# Altium project BlinkBoard_micro.PrjPcb (part 2 of 2)

## Sheet BlinkBoard_micro_v1_JACDAC.SchDoc: BlinkBoard
size A3; DrawnBy: Andrea; Revision: 0.1.0; SheetNumber: 3; SheetTotal: 3
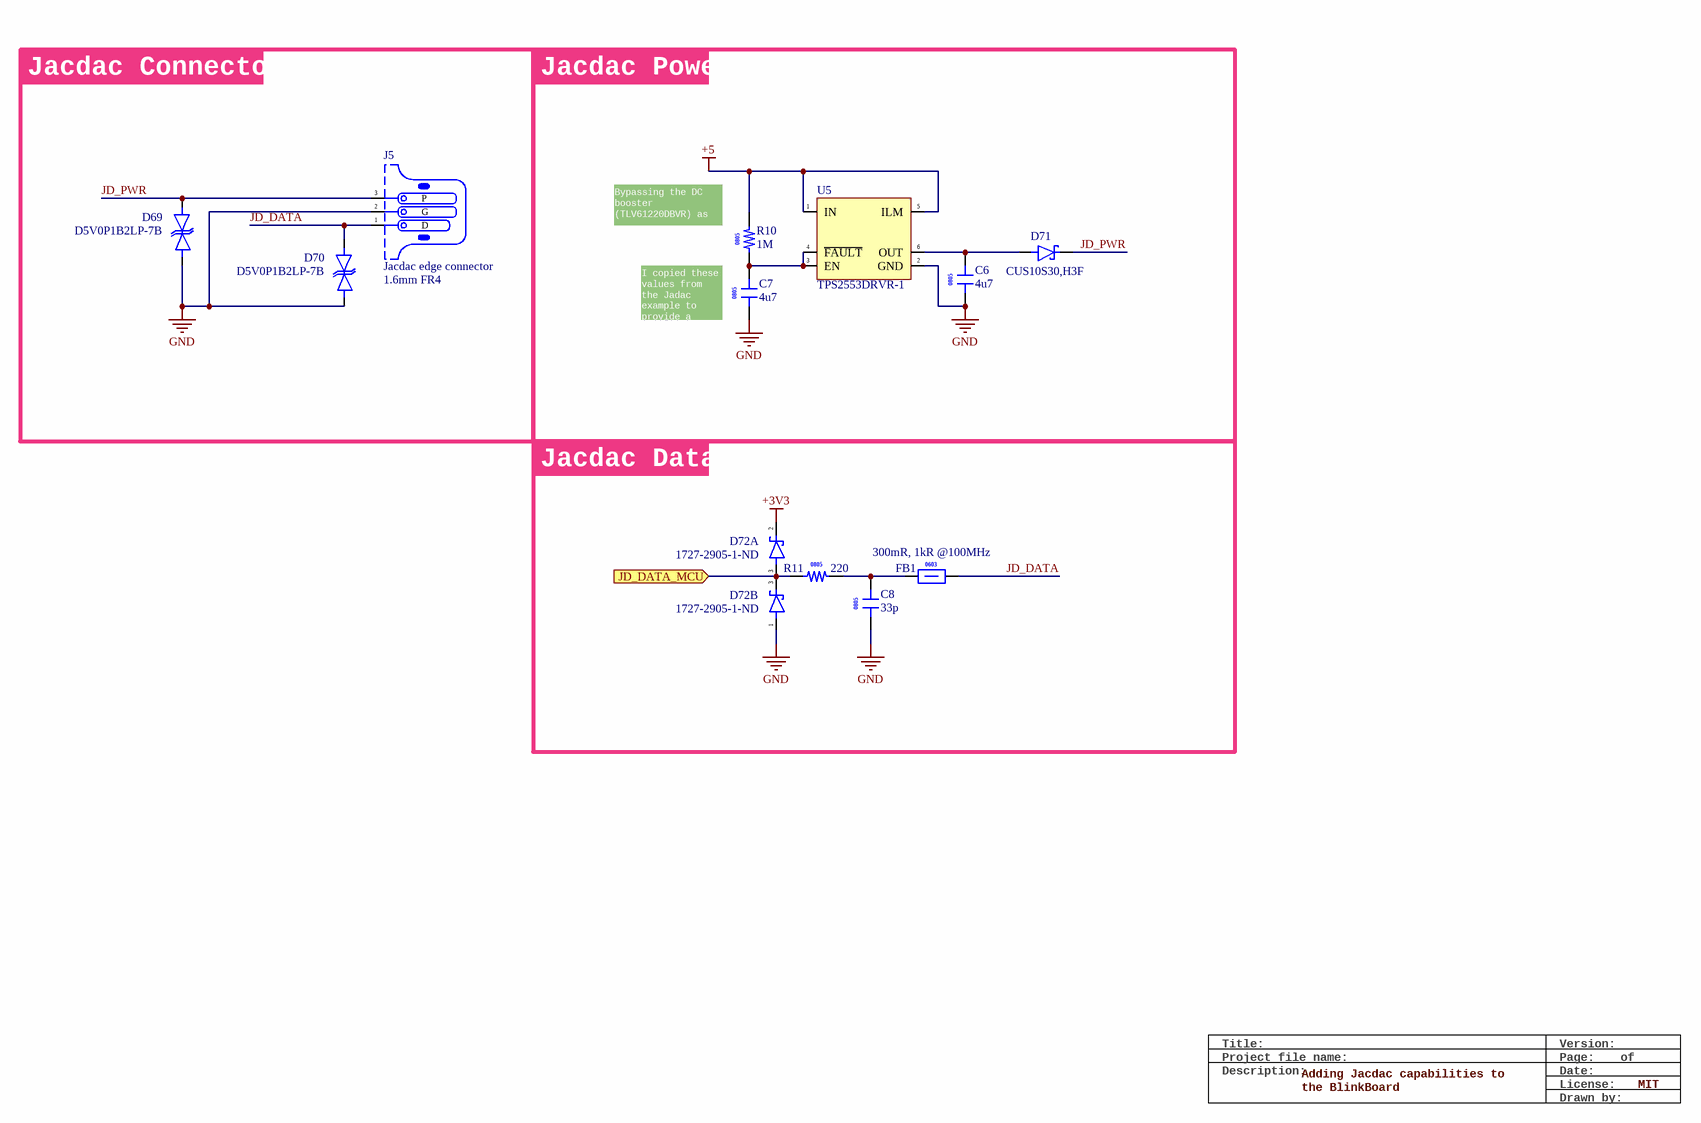
[diagram p2: BlinkBoard_micro_v1_JACDAC.SchDoc]

### Parts
C6  4u7  [C0805]
C7  4u7  [C0805]
C8  33p  [C0805]
D69  D5V0P1B2LP-7B  [D5V0P1B2LP]
D70  D5V0P1B2LP-7B  [D5V0P1B2LP]
D71  CUS10S30,H3F  [FP-USC-MFG]
D72  1727-2905-1-ND  [SOT323]  (parts A,B of 2)
FB1  300mR, 1kR @100MHz  [BEAD0603]
J5  Jacdac edge connector  PCB Type: 1.6mm FR4  [JACDAC_EDGE_CONNECTOR_NO_TRACES]  (no BOM)
R10  1M  [R0805]
R11  220  [R0805]
U5  TPS2553DRVR-1  [DRV0006A_V]

### Blocks framed on the sheet
Jacdac Connector: D69 D70 J5
Jacdac Power: C6 C7 D71 R10 U5
Jacdac Data: C8 D72 FB1 R11

### Ports
JD_DATA_MCU (in)

### Nets
+3V3: D72.2
+5: R10.2 U5.1(IN) U5.5(ILM)
GND: C6.1 C7.1 C8.1 D69.1 D70.1 D72.1 J5.2(G) U5.2(GND)
JD_DATA: D70.2 FB1.2 J5.1(D)
JD_PWR: D69.2 D71.1(C) J5.3(P)
NetC6_2: C6.2 D71.2(A) U5.6(OUT)
NetC7_2: C7.2 R10.1 U5.3(EN) U5.4(~{FAULT})
NetC8_2: C8.2 FB1.1 R11.2
NetD72_3: D72.3 R11.1 ; port JD_DATA_MCU

### Notes on the sheet
- (near R10) Bypassing the DC booster (TLV61220DBVR) as we already have 5V
- I copied these values from the Jadac example to provide a  750ms reset time
- Title:
- Description:
- Project file name:
- Drawn by:
- License:
- Page:
- Version:
- Date:
- of
- MIT
- Adding Jacdac capabilities to the BlinkBoard

### Library data of the parts
C6 C7 = C0805_4u7: Multilayer Ceramic Capacitors MLCC - SMD/SMT 4.7uF 6.3V X5R 10%; Manufacturer: Yageo; Manufacturer Part Number: CC0805KRX5R5BB475; Supplier 1: Digi-Key; RoHS: Yes; Category: Ceramic Capacitors; Stock 1: 19993; Mount: Surface Mount; Case/Package: 0805; Number of Pins: 2; Case Code (Imperial): 0805; Case Code (Metric): 2012; Weight: 0.000194oz; Min Operating Temperature: -55°C; Max Operating Temperature: 85°C; Capacitance: 4.7uF; Tolerance: 10%; Packaging: Tape and Reel; Voltage Rating (DC): 6.3V; Voltage Rating: 6.3V; Dielectric: X5R; Termination: SMD/SMT; Resistor Type: Ceramic; Series: CC; Length: 0.079inch; Width: 0.049inch; Thickness: 0.057inch; Lead Free: Lead Free; Halogen Free: Halogen Free; RoHS Compliant: Yes; ComponentLink1URL: http://www.mouser.com/ds/2/447/UPY-GPHC_X5R_4V-to-50V_25-1131599.pdf?src-supplier=Mouser; ComponentLink1Description: http://www.mouser.com/ds/2/447/UPY-GPHC_X5R_4V-to-50V_25-1131599.pdf?src-supplier=Mouser; ComponentLink2URL: http://components.arrow.com/part/dataview/0323_04166591?src-supplier=Arrow+Europe; ComponentLink2Description: http://components.arrow.com/part/dataview/0323_04166591?src-supplier=Arrow+Europe; ComponentLink3URL: http://www.yageo.com/documents/recent/UPY-GPHC_X5R_4V-to-50V_25.pdf?src-supplier=Digi-Key; ComponentLink3Description: http://www.yageo.com/documents/recent/UPY-GPHC_X5R_4V-to-50V_25.pdf?src-supplier=Digi-Key; ComponentLink4URL: http://www.yageo.com/documents/recent/UPY-GPHC_X5R_4V-to-50V_23.pdf?src-supplier=Digi-Key; ComponentLink4Description: http://www.yageo.com/documents/recent/UPY-GPHC_X5R_4V-to-50V_23.pdf?src-supplier=Digi-Key; Supplier Part Number 1: 311-3422-1-ND; Pricing 1: 1=0.17000, 10=0.12300, 50=0.07000, 100=0.05800, 500=0.04066, 1000=0.03365 (USD)
C8 = C0805_33p: Cap Ceramic 33pF 50V C0G 5% SMD 0805 125C Paper T/R; Manufacturer: Yageo; Manufacturer Part Number: CC0805JRNPO9BN330; Supplier 1: Digi-Key; RoHS: Yes; Category: Ceramic Capacitors; Stock 1: 41012; Mount: Surface Mount; Case/Package: 0805; Case Code (Imperial): 0805; Case Code (Metric): 2012; Material: Ceramic; Dielectric Material: Ceramic; Min Operating Temperature: -55°C; Max Operating Temperature: 125°C; Capacitance: 33pF; Package Quantity: 1; Voltage Rating: 50V; Voltage Rating (DC): 50V; Tolerance: 5%; Packaging: Tape and Reel; Dielectric: C0G; Termination: SMD/SMT; Resistor Type: Ceramic; Voltage: 50V; Series: CC; Length: 2mm; Width: 1.25mm; Height: 0.6mm; Thickness: 0.024inch; Depth: 1.25mm; Radiation Hardening: No; REACH SVHC: Unknown; Lead Free: Lead Free; RoHS Compliant: Yes; ComponentLink1URL: https://datasheet.ciiva.com/144/mlccorderingcode-144778.pdf?src-supplier=Digi-Key; ComponentLink1Description: https://datasheet.ciiva.com/144/mlccorderingcode-144778.pdf?src-supplier=Digi-Key; ComponentLink2URL: https://datasheet.ciiva.com/144/mlccorderingcode-144779.pdf?src-supplier=Digi-Key; ComponentLink2Description: https://datasheet.ciiva.com/144/mlccorderingcode-144779.pdf?src-supplier=Digi-Key; ComponentLink3URL: https://datasheet.ciiva.com/144/mlccorderingcode-144780.pdf?src-supplier=Digi-Key; ComponentLink3Description: https://datasheet.ciiva.com/144/mlccorderingcode-144780.pdf?src-supplier=Digi-Key; ComponentLink4URL: https://datasheet.ciiva.com/11464/upy-gp-np0-16v-to-50v-8-11464747.pdf?src-supplier=Avnet; ComponentLink4Description: https://datasheet.ciiva.com/11464/upy-gp-np0-16v-to-50v-8-11464747.pdf?src-supplier=Avnet; ComponentLink5URL: https://datasheet.ciiva.com/8033/1443161-8033942.pdf?src-supplier=Element14; ComponentLink5Description: https://datasheet.ciiva.com/8033/1443161-8033942.pdf?src-supplier=Element14; ComponentLink6URL: https://datasheet.ciiva.com/8033/1443161-8033944.pdf?src-supplier=Element14; ComponentLink6Description: https://datasheet.ciiva.com/8033/1443161-8033944.pdf?src-supplier=Element14; ComponentLink7URL: https://datasheet.ciiva.com/16625/upy-gp-np0-16v-to-50v-8-16625541.pdf?src-supplier=Avnet+Europe; ComponentLink7Description: https://datasheet.ciiva.com/16625/upy-gp-np0-16v-to-50v-8-16625541.pdf?src-supplier=Avnet+Europe; ComponentLink8URL: https://datasheet.ciiva.com/29241/445349-da-01-en-kerko-chip-0805-np0-33pf-5proz-50v-g-29241975.pdf?src-supplier=Conrad; ComponentLink8Description: https://datasheet.ciiva.com/29241/445349-da-01-en-kerko-chip-0805-np0-33pf-5proz-50v-g-29241975.pdf?src-supplier=Conrad; Supplier Part Number 1: 311-1105-1-ND; Pricing 1: 1=0.11000, 10=0.07800, 50=0.04280, 100=0.03490, 500=0.02492, 1000=0.01958 (USD)
D69 D70 = ZENER: TVS DIODE 5.5V 13V DFN1006-2; Manufacturer: Diodes; Number of Bidirectional Channels: 1; Min Breakdown Voltage: 6V; Power Line Protection: No; Polarity: Bidirectional; Breakdown Voltage: 7V; Max Surge Current: 4A; Max Power Dissipation: 250mW; Element Configuration: Single; ESD Protection: Yes; Max Reverse Leakage Current: 100nA; Supplier 1: Digi-Key; Manufacturer Part Number: D5V0P1B2LP-7B; RoHS: Yes; Category: TVS Diodes; Stock 1: 24260; Mount: Surface Mount; Case/Package: DFN; Number of Pins: 2; Contact Plating: Gold; Min Operating Temperature: -65°C; Max Operating Temperature: 150°C; Packaging: Tape and Reel; Reverse Standoff Voltage: 5.5V; Clamping Voltage: 13V; Termination: SMD/SMT; Working Voltage: 5.5V; Package Quantity: 10000; Direction: Bidirectional; Peak Pulse Current: 4A; Peak Pulse Power: 250mW; Resistor Type: Zener; RoHS Compliant: Yes; ComponentLink1URL: http://www.mouser.com/ds/2/115/D5V0P1B2LP-368667.pdf?src-supplier=Mouser; ComponentLink1Description: http://www.mouser.com/ds/2/115/D5V0P1B2LP-368667.pdf?src-supplier=Mouser; ComponentLink2URL: http://www.diodes.com/_files/datasheets/D5V0P1B2LP.pdf?src-supplier=Avnet; ComponentLink2Description: http://www.diodes.com/_files/datasheets/D5V0P1B2LP.pdf?src-supplier=Avnet; ComponentLink3URL: https://www.diodes.com/assets/Datasheets/D5V0P1B2LP.pdf?src-supplier=Digi-Key; ComponentLink3Description: https://www.diodes.com/assets/Datasheets/D5V0P1B2LP.pdf?src-supplier=Digi-Key; Supplier Part Number 1: D5V0P1B2LP-7BDICT-ND; Pricing 1: 1=0.28000, 10=0.22700, 100=0.12040, 500=0.07920, 1000=0.05386, 2000=0.04858, 5000=0.04224 (USD)
D71 = SCHOTTKY_1A: DIODE SCHOTTKY 30V 1A USC; Manufacturer: Toshiba; Max Reverse Current: 500uA; Peak Non-Repetitive Surge Current: 5A; Element Configuration: Single; Supplier 1: Digi-Key; Manufacturer Part Number: CUS10S30,H3F; RoHS: No; Category: Rectifier Diodes; Stock 1: 85731; Mount: Surface Mount; Case/Package: SOD; Number of Pins: 2; Contact Plating: Tin,Silver; Min Operating Temperature: -55°C; Max Operating Temperature: 125°C; Packaging: Cut Tape; Average Rectified Current: 1A; Max Reverse Voltage (DC): 30V; RoHS Compliant: No; ComponentLink1URL: http://toshiba.semicon-storage.com/info/docget.jsp?did=14077&prodName=CUS10S30&src-supplier=Avnet; ComponentLink1Description: http://toshiba.semicon-storage.com/info/docget.jsp?did=14077&prodName=CUS10S30&src-supplier=Avnet; ComponentLink2URL: http://toshiba.semicon-storage.com/info/lookup.jsp?pid=CUS10S30&amp;lang=en&src-supplier=Mouser; ComponentLink2Description: http://toshiba.semicon-storage.com/info/lookup.jsp?pid=CUS10S30&amp;lang=en&src-supplier=Mouser; ComponentLink3URL: https://toshiba.semicon-storage.com/info/docget.jsp?did=14077&prodName=CUS10S30&src-supplier=Digi-Key; ComponentLink3Description: https://toshiba.semicon-storage.com/info/docget.jsp?did=14077&prodName=CUS10S30&src-supplier=Digi-Key; Supplier Part Number 1: CUS10S30H3FCT-ND; Pricing 1: 1=0.38000, 10=0.28200, 100=0.15950, 500=0.10560, 1000=0.08096 (USD)
D72 = BAT54SW: Rectifier Diode Schottky 0.2A 5ns Automotive 3-Pin SC-70 T/R; Manufacturer: Nexperia; Manufacturer Part Number: BAT54SW,115; Supplier 1: Digi-Key; RoHS: Yes; Category: Rectifier Diodes; Stock 1: 166801; ComponentLink1URL: http://www.farnell.com/datasheets/1679676.pdf?src-supplier=Farnell; ComponentLink1Description: http://www.farnell.com/datasheets/1679676.pdf?src-supplier=Farnell; ComponentLink2URL: https://assets.nexperia.com/documents/data-sheet/BAT54W_SER.pdf?src-supplier=Digi-Key; ComponentLink2Description: https://assets.nexperia.com/documents/data-sheet/BAT54W_SER.pdf?src-supplier=Digi-Key; Supplier Part Number 1: 1727-2905-1-ND; Pricing 1: 1=0.23000, 10=0.20900, 100=0.11400, 500=0.07018, 1000=0.04785 (USD)
FB1 = BEAD0603: Ferrite Beads Multi-Layer Chip Bead 1KOhm 25% 100MHz 600mA 0603 T/R; Manufacturer: Wurth Electronics; Manufacturer Part Number: 742792662; Number of Lines: 1; Test Frequency: 120MHz; Supplier 1: Digi-Key; RoHS: Yes; Category: Ferrite Beads and Chips; Stock 1: 259725; Mount: Surface Mount; Case/Package: SMD/SMT; Case Code (Metric): 1608; Case Code (Imperial): 0603; Weight: 7.1E-05oz; Material: Ferrite; Min Operating Temperature: -55°C; Max Operating Temperature: 125°C; Package Quantity: 4000; Packaging: Tape and Reel; Tolerance: 25%; Impedance: 1kR; Max Current Rating: 600mA; DC Resistance (DCR): 300mR; Max DC Current: 600mA; Termination: SMD/SMT; Length: 1.6mm; Width: 0.031inch; Height: 0.8mm; Depth: 0.8mm; Lead Free: Lead Free; RoHS Compliant: Yes; ComponentLink1URL: https://datasheet.ciiva.com/29364/742792662-29364469.pdf?src-supplier=Digi-Key; ComponentLink1Description: https://datasheet.ciiva.com/29364/742792662-29364469.pdf?src-supplier=Digi-Key; ComponentLink2URL: https://datasheet.ciiva.com/30489/0900766b812a6756-30489145.pdf?src-supplier=RSComponents; ComponentLink2Description: https://datasheet.ciiva.com/30489/0900766b812a6756-30489145.pdf?src-supplier=RSComponents; ComponentLink3URL: https://datasheet.ciiva.com/29364/742792662-29364471.pdf?src-supplier=Digi-Key; ComponentLink3Description: https://datasheet.ciiva.com/29364/742792662-29364471.pdf?src-supplier=Digi-Key; ComponentLink4URL: https://datasheet.ciiva.com/29364/742792662-29364473.pdf?src-supplier=Digi-Key; ComponentLink4Description: https://datasheet.ciiva.com/29364/742792662-29364473.pdf?src-supplier=Digi-Key; Supplier Part Number 1: 732-4670-1-ND; Pricing 1: 1=0.17000, 50=0.16800, 100=0.15500, 500=0.14800, 1000=0.14100, 2000=0.13400 (USD)
J5 = Jacdac edge connector: 3 pin Jacdac edge connector 1.27mm pitch; Manufacturer Part Number: JACDAC_EDGE_CONNECTOR; Checked By: S. Hodges; Created By: D. Gakure; ComponentLink1Description: Yuliang Jacdac cable connector drawing online; ComponentLink1URL: https://github.com/microsoft/jacdac-mdk/blob/main/connector/JACDAC-Connector-by-Yuliang-2020-11-28.pdf; ComponentLink2Description: Jacdac PCB edge connector spec onlin; ComponentLink2URL: https://github.com/microsoft/jacdac-mdk/blob/main/connector/JACDAC_PCB_Edge_Connector_Drawing_JD-PEC-01_rev_01.pdf
R10 = R0805_1M: RES SMD 1M OHM 0.1% 1/8W 0805; Manufacturer: Yageo; Manufacturer Part Number: RT0805BRE071ML; Resistance: 1MR; Power Rating: 125mW; Voltage Rating: 150V; Temperature Coefficient: 50ppm/°C; Supplier 1: Digi-Key; RoHS: Yes; Category: Chip SMD Resistors; Stock 1: 10866; Case/Package: 0805; Case Code (Metric): 2012; Case Code (Imperial): 0805; Contact Plating: Tin,Matte; Min Operating Temperature: -55°C; Max Operating Temperature: 125°C; Tolerance: 0.1%; Packaging: Tape and Reel; Resistor Type: Thin Film; Termination: SMD/SMT; Voltage Rating (DC): 150V; Series: RT; Length: 2mm; Width: 1.25mm; Height: 500um; Radiation Hardening: No; Lead Free: Lead Free; RoHS Compliant: Yes; ComponentLink1URL: https://datasheet.ciiva.com/8896/pyu-rt-1-to-0-05-rohs-l-4-8896102.pdf?src-supplier=Avnet; ComponentLink1Description: https://datasheet.ciiva.com/8896/pyu-rt-1-to-0-05-rohs-l-4-8896102.pdf?src-supplier=Avnet; ComponentLink2URL: https://datasheet.ciiva.com/12723/pyu-rt-1-to-0-05-rohs-l-4-12723621.pdf?src-supplier=Mouser; ComponentLink2Description: https://datasheet.ciiva.com/12723/pyu-rt-1-to-0-05-rohs-l-4-12723621.pdf?src-supplier=Mouser; Supplier Part Number 1: YAG4967CT-ND; Pricing 1: 1=0.40000, 10=0.31000, 100=0.13050, 1000=0.07200, 2500=0.06750 (USD)
R11 = R0805_220: Res General Purpose Thick Film 0805 220 Ohm 5% 1/8W ±100ppm/°C Molded SMD Paper T/R; Manufacturer: Yageo; Manufacturer Part Number: RC0805JR-07220RL; Resistance: 220R; Power Rating: 125mW; Voltage Rating: 150V; Supplier 1: Digi-Key; RoHS: Yes; Category: Chip SMD Resistors; Stock 1: 650208; Case/Package: 0805; Case Code (Imperial): 0805; Case Code (Metric): 2012; Contact Plating: Tin,Matte,Lead; Size Code: 0805; Min Operating Temperature: -55°C; Max Operating Temperature: 155°C; Tolerance: 5%; Packaging: Tape and Reel; Termination: SMD/SMT; Resistor Type: Thick Film; Temperature Coefficient: 100ppm/°C; Features: Moisture Resistant; Series: RC; Max Power Dissipation: 125mW; Number of Terminations: 2; Resistance Tolerance: 5%; Construction: Rectangular; Length: 2mm; Depth: 1.25mm; Radiation Hardening: No; REACH SVHC: Unknown; Military Standard: Not; Lead Free: Lead Free; RoHS Compliant: Yes; ComponentLink1URL: https://datasheet.ciiva.com/7941/442941-7941917.pdf?src-supplier=Element14; ComponentLink1Description: https://datasheet.ciiva.com/7941/442941-7941917.pdf?src-supplier=Element14; ComponentLink2URL: https://datasheet.ciiva.com/7941/442941-7941918.pdf?src-supplier=Element14; ComponentLink2Description: https://datasheet.ciiva.com/7941/442941-7941918.pdf?src-supplier=Element14; ComponentLink3URL: https://datasheet.ciiva.com/16914/rc0805-16914046.pdf?src-supplier=Future+Electronics; ComponentLink3Description: https://datasheet.ciiva.com/16914/rc0805-16914046.pdf?src-supplier=Future+Electronics; Supplier Part Number 1: 311-220ARCT-ND; Pricing 1: 1=0.10000, 10=0.03600, 100=0.01450, 1000=0.00652, 2500=0.00566 (USD)
U5 = TPS2553: IC PWR DIST SWITCH ADJ 6SON; Manufacturer: Texas Instruments; Min Supply Voltage: 2.5V; Max Supply Voltage: 6.5V; Number of Outputs: 1; Interface: On/Off; Max Output Current: 1.5A; Fault Protection: Over Temperature; Output Configuration: High Side; Supplier 1: Digi-Key; Manufacturer Part Number: TPS2553DRVR-1; RoHS: Yes; Category: Hot Swap Controllers; Case/Package: SON; Number of Pins: 6; Weight: 0.000342oz; Min Operating Temperature: -40°C; Max Operating Temperature: 85°C; Packaging: Tape and Reel; Package Quantity: 3000; Max Input Voltage: 6.5V; Min Input Voltage: 2.5V; Series: -; Number of Switches: 1; Radiation Hardening: No; Lead Free: Lead Free; RoHS Compliant: Yes; ComponentLink1URL: https://datasheet.ciiva.com/15108/getdatasheetpartid-625184-15108813.pdf?src-supplier=Verical; ComponentLink1Description: https://datasheet.ciiva.com/15108/getdatasheetpartid-625184-15108813.pdf?src-supplier=Verical; ComponentLink2URL: https://datasheet.ciiva.com/1963/tps2552-1963661.pdf?src-supplier=Digi-Key; ComponentLink2Description: https://datasheet.ciiva.com/1963/tps2552-1963661.pdf?src-supplier=Digi-Key; ComponentLink3URL: https://datasheet.ciiva.com/26072/tps2553-1-26072302.pdf?src-supplier=Avnet+Europe; ComponentLink3Description: https://datasheet.ciiva.com/26072/tps2553-1-26072302.pdf?src-supplier=Avnet+Europe; Supplier Part Number 1: 296-39381-1-ND; Pricing 1: 1=0.91000, 10=0.81300, 25=0.77160, 100=0.63390, 250=0.59256, 500=0.52364, 1000=0.45500 (USD)

## Nets that join several sheets
+3V3: BlinkBoard_micro_v1 (12 pins), BlinkBoard_micro_v1_JACDAC (D72.2)
+5: BlinkBoard_micro_v1 (73 pins), BlinkBoard_micro_v1_JACDAC (R10.2 U5.1 U5.5)
GND: BlinkBoard_micro_v1 (79 pins), BlinkBoard_micro_v1_JACDAC (8 pins)
NetD72_3: BlinkBoard_micro_v1 (J1.18), BlinkBoard_micro_v1_JACDAC (D72.3 R11.1)